# Altium schematic sheet Sheet1.SchDoc
size D
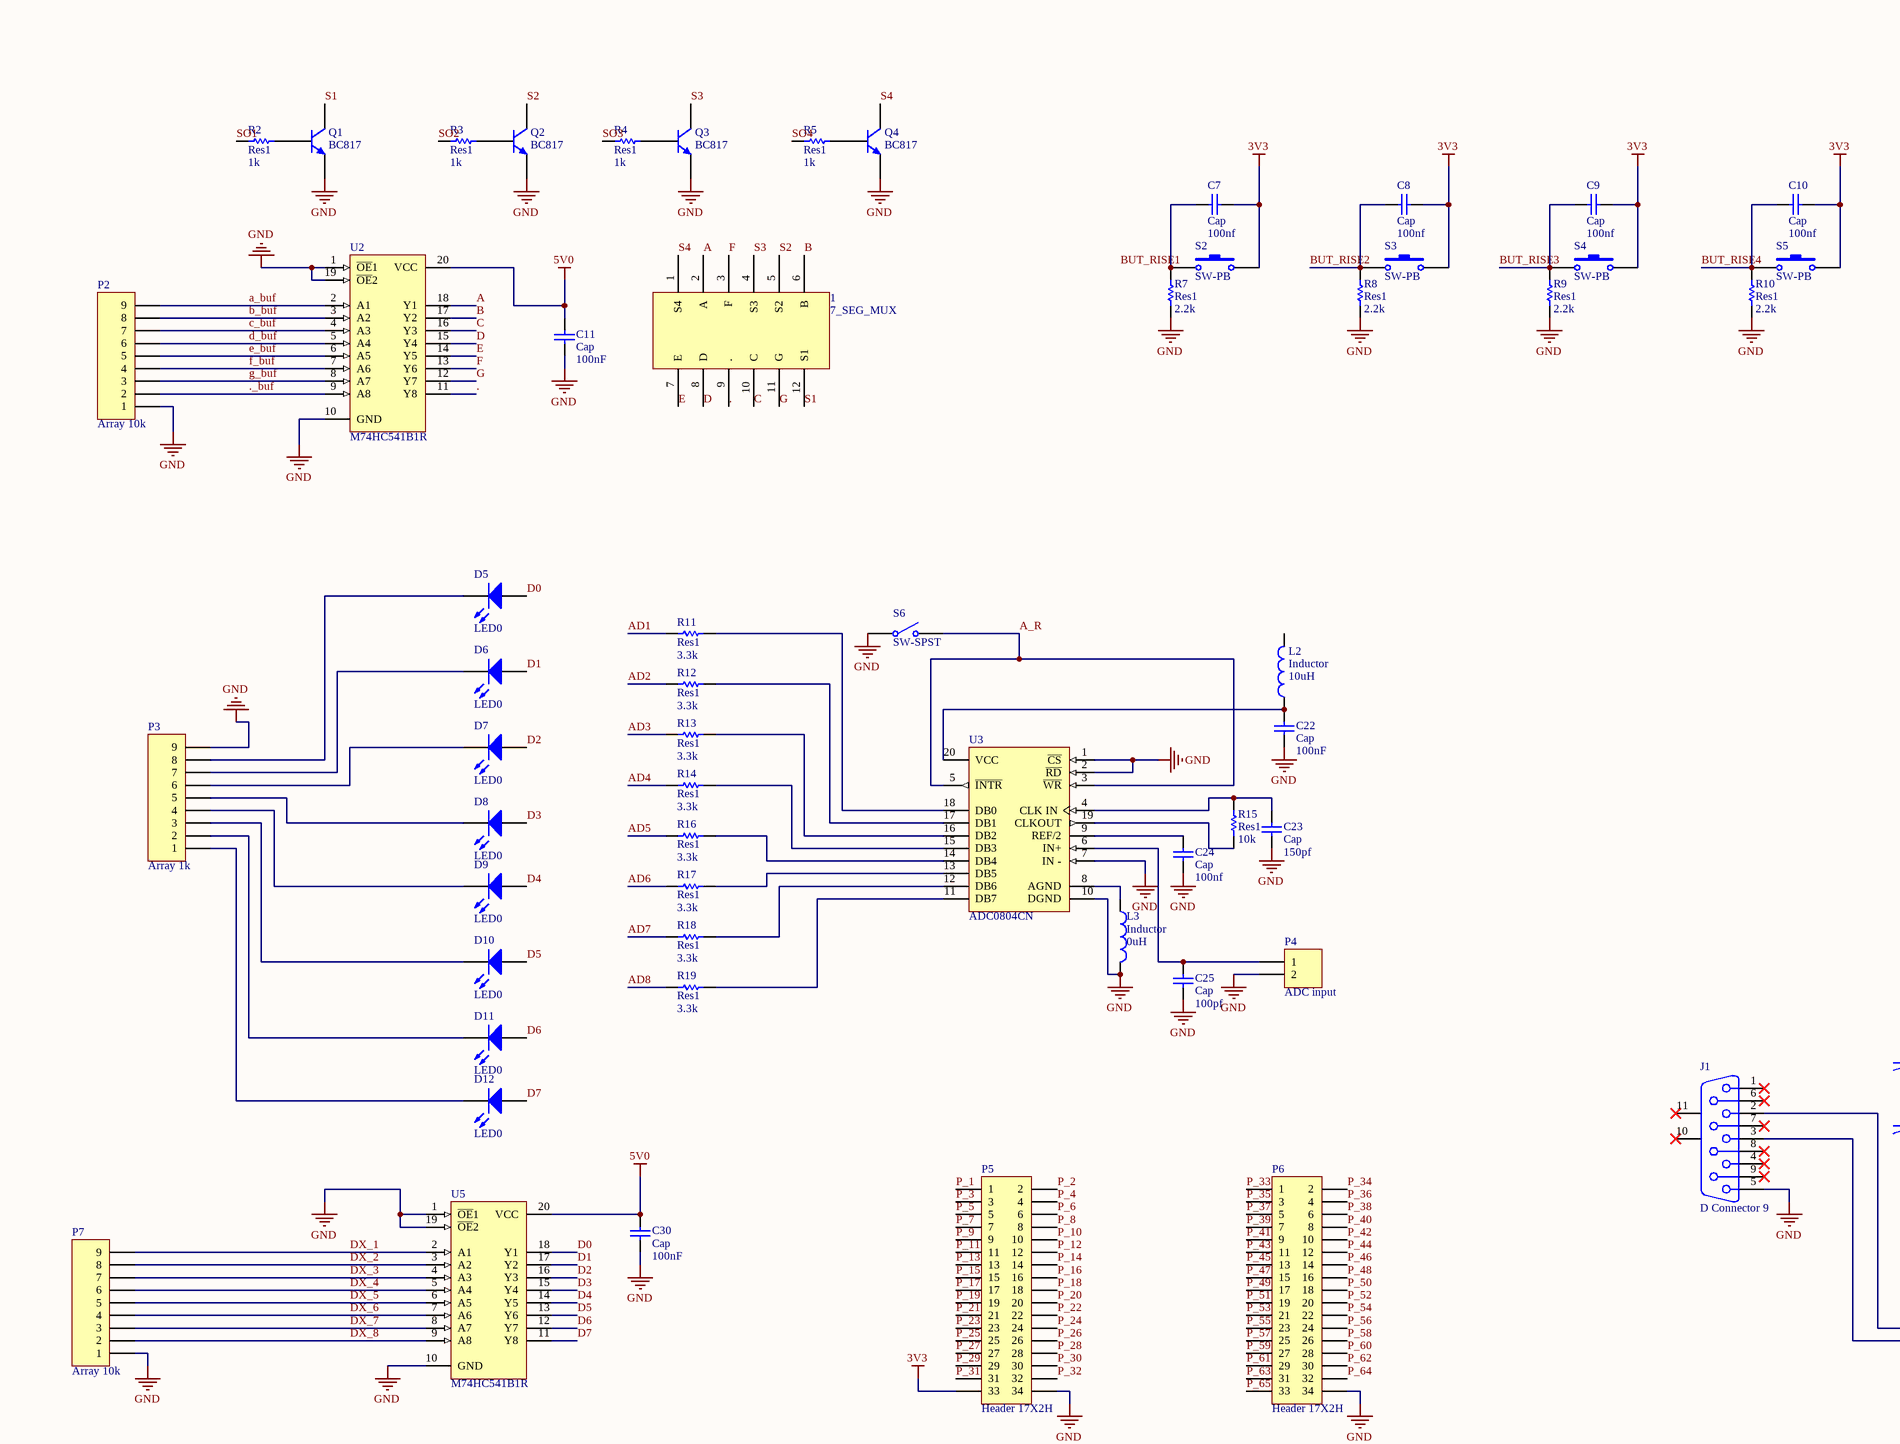
[diagram p0: Sheet1.SchDoc, top left]
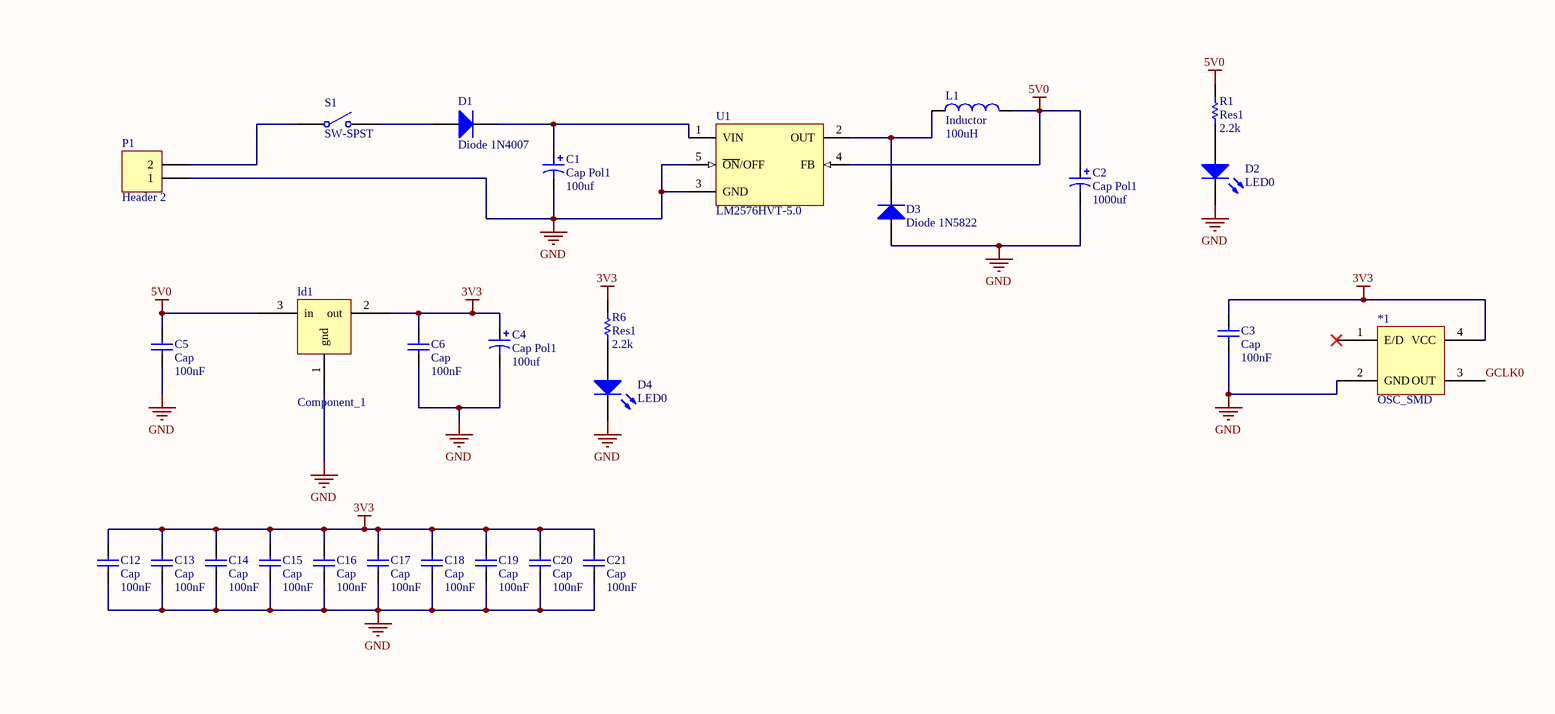
[diagram p1: Sheet1.SchDoc, top right]
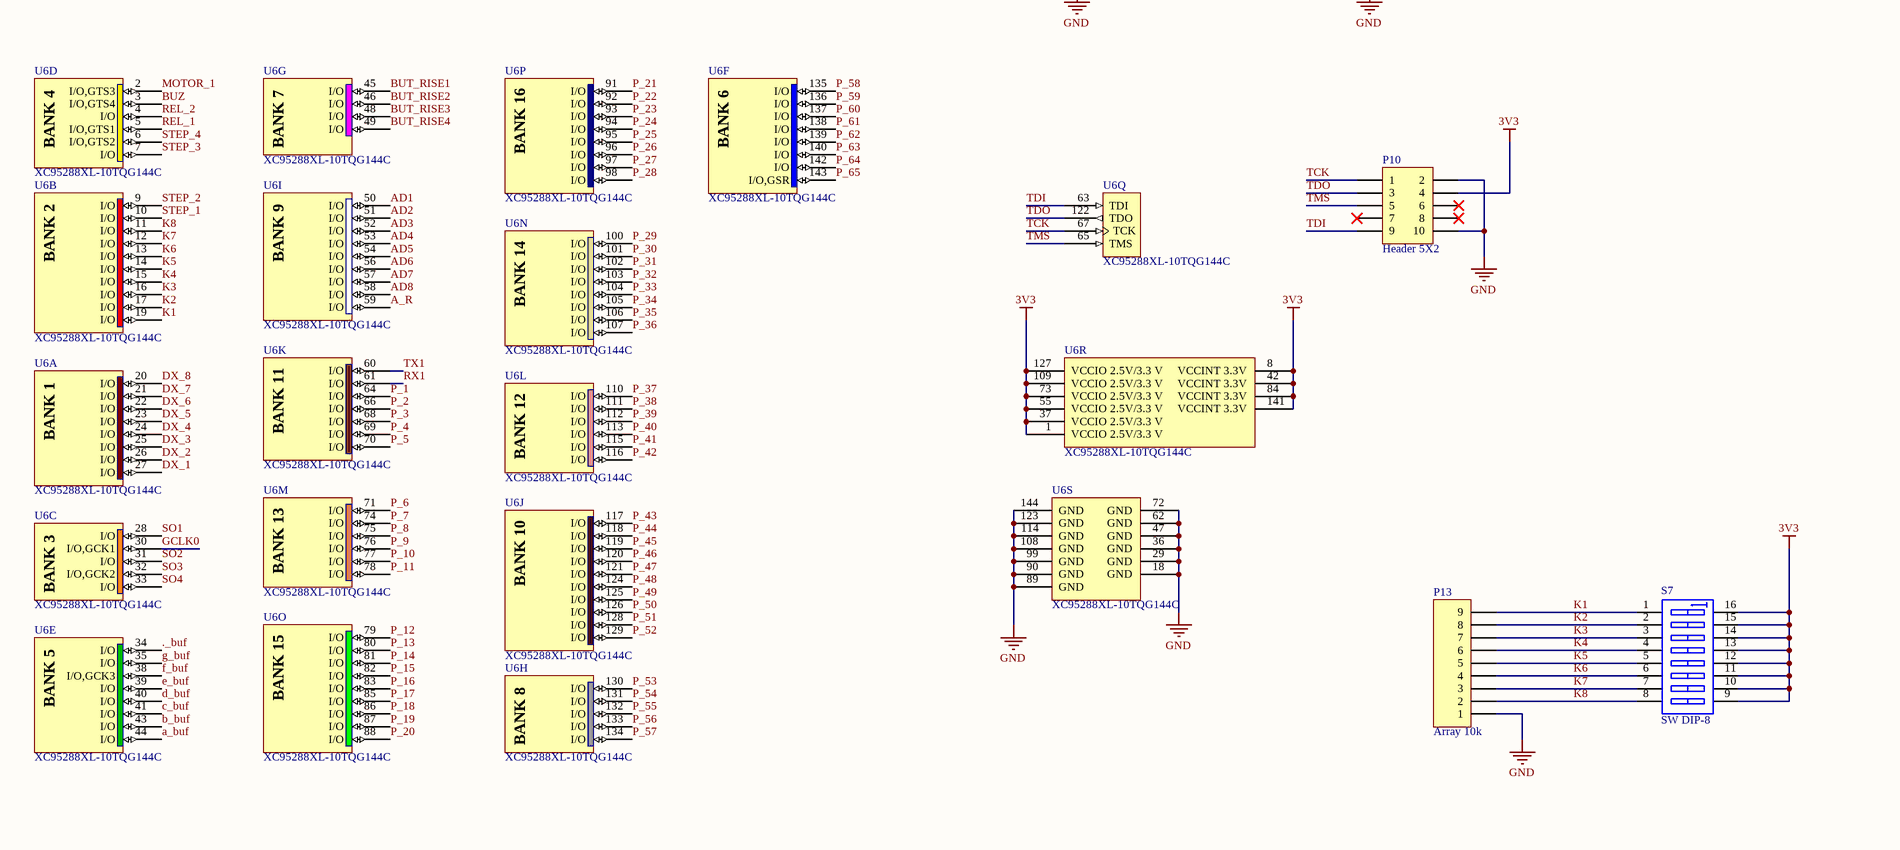
[diagram p2: Sheet1.SchDoc, bottom left]
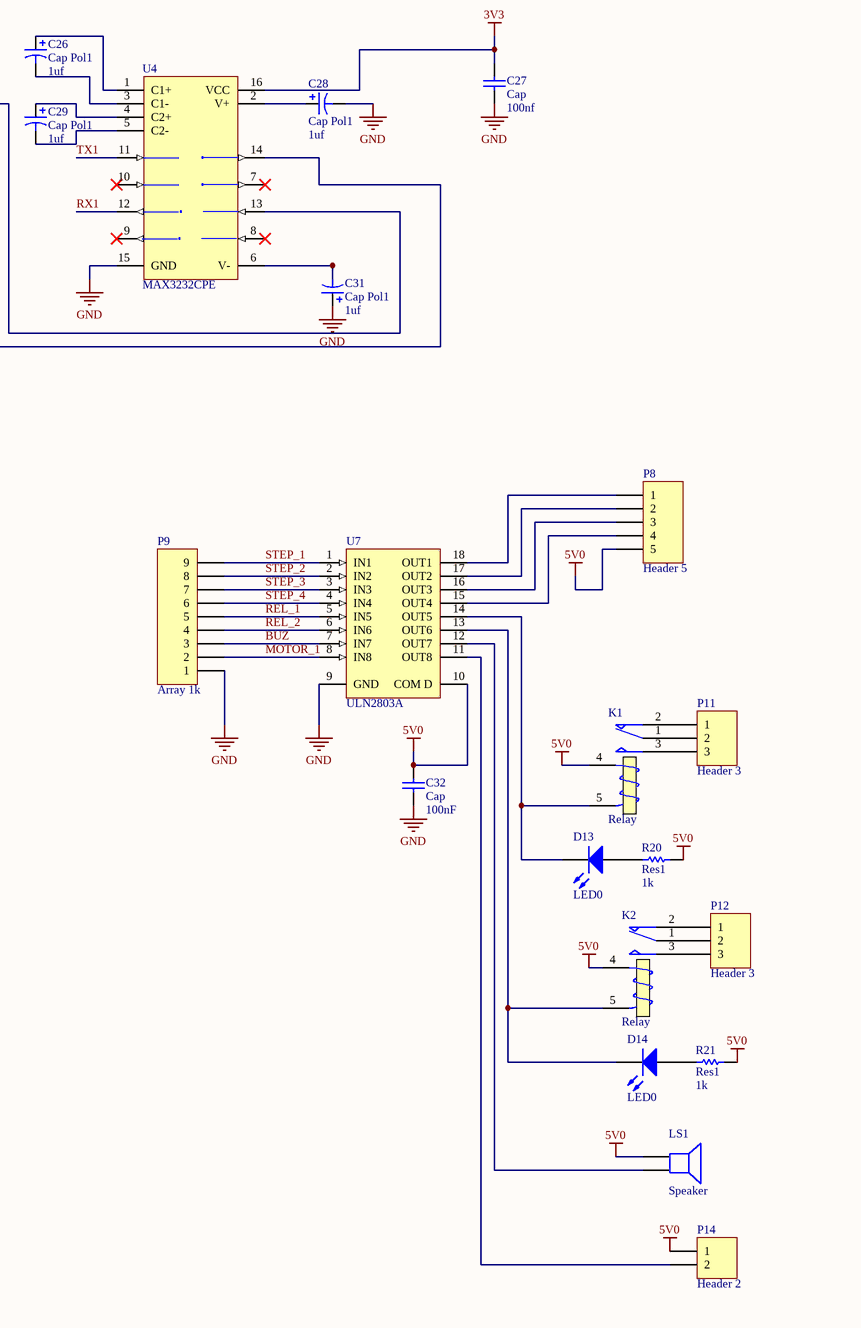
[diagram p3: Sheet1.SchDoc, bottom right]

## Parts
1  7_SEG_MUX  [s7_mux]
*1  OSC_SMD  [osc_smd]
C1  Cap Pol1  value 100uf  [C_CYL_SMD2]
C2  Cap Pol1  value 1000uf  [C_CYL_SMD]
C3  Cap  value 100nF  [SMD_805]
C4  Cap Pol1  value 100uf  [C_B]
C5  Cap  value 100nF  [SMD_805]
C6  Cap  value 100nF  [SMD_805]
C7  Cap  value 100nf  [SMD_805]
C8  Cap  value 100nf  [SMD_805]
C9  Cap  value 100nf  [SMD_805]
C10  Cap  value 100nf  [SMD_805]
C11  Cap  value 100nF  [SMD_805]
C12  Cap  value 100nF  [SMD_805]
C13  Cap  value 100nF  [SMD_805]
C14  Cap  value 100nF  [SMD_805]
C15  Cap  value 100nF  [SMD_805]
C16  Cap  value 100nF  [SMD_805]
C17  Cap  value 100nF  [SMD_805]
C18  Cap  value 100nF  [SMD_805]
C19  Cap  value 100nF  [SMD_805]
C20  Cap  value 100nF  [SMD_805]
C21  Cap  value 100nF  [SMD_805]
C22  Cap  value 100nF  [SMD_805]
C23  Cap  value 150pf  [SMD_805]
C24  Cap  value 100nf  [SMD_805]
C25  Cap  value 100pf  [SMD_805]
C26  Cap Pol1  value 1uf  [c_b]
C27  Cap  value 100nf  [SMD_805]
C28  Cap Pol1  value 1uf  [c_b]
C29  Cap Pol1  value 1uf  [c_b]
C30  Cap  value 100nF  [SMD_805]
C31  Cap Pol1  value 1uf  [c_b]
C32  Cap  value 100nF  [SMD_805]
D1  Diode 1N4007  [TVS]
D2  LED0  [SMD_805]
D3  Diode 1N5822  [1N5822]
D4  LED0  [SMD_805]
D5  LED0  [SMD_805]
D6  LED0  [SMD_805]
D7  LED0  [SMD_805]
D8  LED0  [SMD_805]
D9  LED0  [SMD_805]
D10  LED0  [SMD_805]
D11  LED0  [SMD_805]
D12  LED0  [SMD_805]
D13  LED0  [SMD_805]
D14  LED0  [SMD_805]
J1  D Connector 9  [com]
K1  Relay  [relay_5v]
K2  Relay  [relay_5v]
L1  Inductor  value 100uH  [INDUC_SMD]
L2  Inductor  value 10uH  [SMD_805]
L3  Inductor  value 0uH  [SMD_805]
ld1  Component_1  [SOT223]
LS1  Speaker  [buzzer]
P1  Header 2  [ADAP_JACK]
P2  Array 10k  [aray 9]
P3  Array 1k  [Aray 9]
P4  ADC input  [pin_2_w]
P5  Header 17X2H  [HDR2X17H]
P6  Header 17X2H  [HDR2X17H]
P7  Array 10k  [aray 9]
P8  Header 5  [pin_5_w]
P9  Array 1k  [aray 9]
P10  Header 5X2  [box2x5_3d]
P11  Header 3  [pin_3_w]
P12  Header 3  [pin_3_w]
P13  Array 10k  [aray 9]
P14  Header 2  [pin_2_w]
Q1  BC817  [sot23]
Q2  BC817  [sot23]
Q3  BC817  [sot23]
Q4  BC817  [sot23]
R1  Res1  value 2.2k  [SMD_805]
R2  Res1  value 1k  [SMD_805]
R3  Res1  value 1k  [SMD_805]
R4  Res1  value 1k  [SMD_805]
R5  Res1  value 1k  [SMD_805]
R6  Res1  value 2.2k  [SMD_805]
R7  Res1  value 2.2k  [SMD_805]
R8  Res1  value 2.2k  [SMD_805]
R9  Res1  value 2.2k  [SMD_805]
R10  Res1  value 2.2k  [SMD_805]
R11  Res1  value 3.3k  [SMD_805]
R12  Res1  value 3.3k  [SMD_805]
R13  Res1  value 3.3k  [SMD_805]
R14  Res1  value 3.3k  [SMD_805]
R15  Res1  value 10k  [SMD_805]
R16  Res1  value 3.3k  [SMD_805]
R17  Res1  value 3.3k  [SMD_805]
R18  Res1  value 3.3k  [SMD_805]
R19  Res1  value 3.3k  [SMD_805]
R20  Res1  value 1k  [SMD_805]
R21  Res1  value 1k  [SMD_805]
S1  SW-SPST  [KEY1]
S2  SW-PB  [res_b]
S3  SW-PB  [res_b]
S4  SW-PB  [res_b]
S5  SW-PB  [res_b]
S6  SW-SPST  [key1]
S7  SW DIP-8  [array_key8]
U1  LM2576HVT-5.0  [LM2576_SMD]
U2  M74HC541B1R  [sop20]
U3  ADC0804CN  [DIp_20p]
U4  MAX3232CPE  [sop16]
U5  M74HC541B1R  [sop20]
U6  XC95288XL-10TQG144C  [TQG144_N]  (parts A,B,C,D,E,F,G,H,I,J,K,L,M,N,O,P,Q,R,S of 19)
U7  ULN2803A  [sol18]

## Nets
3V3: *1.4(VCC) C3.1 C4.1 C6.1 C7.2 C8.2 C9.2 C10.2 C12.1 C13.1 C14.1 C15.1 C16.1 C17.1 C18.1 C19.1 C20.1 C21.1 C27.2 ld1.2(out) P5.33 P10.4 R6.2 S2.2 S3.2 S4.2 S5.2 S7.9(B8) S7.10(B7) S7.11(B6) S7.12(B5) S7.13(B4) S7.14(B3) S7.15(B2) S7.16(B1) U4.16(VCC) U6.1(VCCIO_2.5V/3.3_V) U6.8(VCCINT_3.3V) U6.37(VCCIO_2.5V/3.3_V) U6.42(VCCINT_3.3V) U6.55(VCCIO_2.5V/3.3_V) U6.73(VCCIO_2.5V/3.3_V) U6.84(VCCINT_3.3V) U6.109(VCCIO_2.5V/3.3_V) U6.127(VCCIO_2.5V/3.3_V) U6.141(VCCINT_3.3V)
5V0: C2.1 C5.1 C11.1 C30.1 C32.1 K1.4(T1) K2.4(T1) L1.2 ld1.3(in) LS1.1 P8.5 P14.1 R1.2 R20.2 R21.2 U1.4(FB) U2.20(VCC) U5.20(VCC) U7.10(COM_D)
GND: *1.2(GND) C1.2 C2.2 C3.2 C4.2 C5.2 C6.2 C11.2 C12.2 C13.2 C14.2 C15.2 C16.2 C17.2 C18.2 C19.2 C20.2 C21.2 C22.2 C23.2 C24.2 C25.2 C27.1 C28.2 C30.2 C31.1 C32.2 D2.2(K) D3.1(A) D4.2(K) J1.5 L3.2 ld1.1(gnd) P1.1 P2.1 P3.9 P4.2 P5.34 P6.34 P7.1 P9.1 P10.2 P10.10 P13.1 Q1.2(E) Q2.2(E) Q3.2(E) Q4.2(E) R7.2 R8.2 R9.2 R10.2 S6.1(COMMON) U1.3(GND) U1.5(~{ON}/OFF) U2.1(~{OE}1) U2.10(GND) U2.19(~{OE}2) U3.1(~{CS}) U3.2(~{RD}) U3.7(IN_-) U3.10(DGND) U4.15(GND) U5.1(~{OE}1) U5.10(GND) U5.19(~{OE}2) U6.18(GND) U6.29(GND) U6.36(GND) U6.47(GND) U6.62(GND) U6.72(GND) U6.89(GND) U6.90(GND) U6.99(GND) U6.108(GND) U6.114(GND) U6.123(GND) U6.144(GND) U7.9(GND)
.: 1.9(.) U2.11(Y8)
._buf: P2.2 U2.9(A8) U6.34(I/O)
A: 1.2(A) U2.18(Y1)
a_buf: P2.9 U2.2(A1) U6.44(I/O)
A_R: S6.2(NO) U3.3(~{WR}) U3.5(~{INTR}) U6.59(I/O)
AD1: R11.1 U6.50(I/O)
AD2: R12.1 U6.51(I/O)
AD3: R13.1 U6.52(I/O)
AD4: R14.1 U6.53(I/O)
AD5: R16.1 U6.54(I/O)
AD6: R17.1 U6.56(I/O)
AD7: R18.1 U6.57(I/O)
AD8: R19.1 U6.58(I/O)
B: 1.6(B) U2.17(Y2)
b_buf: P2.8 U2.3(A2) U6.43(I/O)
BUT_RISE1: U6.45(I/O)
BUT_RISE2: C8.1 R8.1 S3.1 U6.46(I/O)
BUT_RISE3: C9.1 R9.1 S4.1 U6.48(I/O)
BUT_RISE4: C10.1 R10.1 S5.1 U6.49(I/O)
BUZ: P9.3 U6.3(I/O,GTS4) U7.7(IN7)
C: 1.10(C) U2.16(Y3)
c_buf: P2.7 U2.4(A3) U6.41(I/O)
D: 1.8(D) U2.15(Y4)
D0: D5.1(A) U5.18(Y1)
D1: D6.1(A) U5.17(Y2)
D2: D7.1(A) U5.16(Y3)
D3: D8.1(A) U5.15(Y4)
D4: D9.1(A) U5.14(Y5)
D5: D10.1(A) U5.13(Y6)
D6: D11.1(A) U5.12(Y7)
D7: D12.1(A) U5.11(Y8)
d_buf: P2.6 U2.5(A4) U6.40(I/O)
DX_1: P7.9 U5.2(A1) U6.27(I/O)
DX_2: P7.8 U5.3(A2) U6.26(I/O)
DX_3: P7.7 U5.4(A3) U6.25(I/O)
DX_4: P7.6 U5.5(A4) U6.24(I/O)
DX_5: P7.5 U5.6(A5) U6.23(I/O)
DX_6: P7.4 U5.7(A6) U6.22(I/O)
DX_7: P7.3 U5.8(A7) U6.21(I/O)
DX_8: P7.2 U5.9(A8) U6.20(I/O)
E: 1.7(E) U2.14(Y5)
e_buf: P2.5 U2.6(A5) U6.39(I/O)
F: 1.3(F) U2.13(Y6)
f_buf: P2.4 U2.7(A6) U6.38(I/O,GCK3)
G: 1.11(G) U2.12(Y7)
g_buf: P2.3 U2.8(A7) U6.35(I/O)
GCLK0: *1.3(OUT) U6.30(I/O,GCK1)
K1: P13.9 S7.1(A1) U6.19(I/O)
K2: P13.8 S7.2(A2) U6.17(I/O)
K3: P13.7 S7.3(A3) U6.16(I/O)
K4: P13.6 S7.4(A4) U6.15(I/O)
K5: P13.5 S7.5(A5) U6.14(I/O)
K6: P13.4 S7.6(A6) U6.13(I/O)
K7: P13.3 S7.7(A7) U6.12(I/O)
K8: P13.2 S7.8(A8) U6.11(I/O)
MOTOR_1: P9.2 U6.2(I/O,GTS3) U7.8(IN8)
P_1: P5.1 U6.64(I/O)
P_2: P5.2 U6.66(I/O)
P_3: P5.3 U6.68(I/O)
P_4: P5.4 U6.69(I/O)
P_5: P5.5 U6.70(I/O)
P_6: P5.6 U6.71(I/O)
P_7: P5.7 U6.74(I/O)
P_8: P5.8 U6.75(I/O)
P_9: P5.9 U6.76(I/O)
P_10: P5.10 U6.77(I/O)
P_11: P5.11 U6.78(I/O)
P_12: P5.12 U6.79(I/O)
P_13: P5.13 U6.80(I/O)
P_14: P5.14 U6.81(I/O)
P_15: P5.15 U6.82(I/O)
P_16: P5.16 U6.83(I/O)
P_17: P5.17 U6.85(I/O)
P_18: P5.18 U6.86(I/O)
P_19: P5.19 U6.87(I/O)
P_20: P5.20 U6.88(I/O)
P_21: P5.21 U6.91(I/O)
P_22: P5.22 U6.92(I/O)
P_23: P5.23 U6.93(I/O)
P_24: P5.24 U6.94(I/O)
P_25: P5.25 U6.95(I/O)
P_26: P5.26 U6.96(I/O)
P_27: P5.27 U6.97(I/O)
P_28: P5.28 U6.98(I/O)
P_29: P5.29 U6.100(I/O)
P_30: P5.30 U6.101(I/O)
P_31: P5.31 U6.102(I/O)
P_32: P5.32 U6.103(I/O)
P_33: P6.1 U6.104(I/O)
P_34: P6.2 U6.105(I/O)
P_35: P6.3 U6.106(I/O)
P_36: P6.4 U6.107(I/O)
P_37: P6.5 U6.110(I/O)
P_38: P6.6 U6.111(I/O)
P_39: P6.7 U6.112(I/O)
P_40: P6.8 U6.113(I/O)
P_41: P6.9 U6.115(I/O)
P_42: P6.10 U6.116(I/O)
P_43: P6.11 U6.117(I/O)
P_44: P6.12 U6.118(I/O)
P_45: P6.13 U6.119(I/O)
P_46: P6.14 U6.120(I/O)
P_47: P6.15 U6.121(I/O)
P_48: P6.16 U6.124(I/O)
P_49: P6.17 U6.125(I/O)
P_50: P6.18 U6.126(I/O)
P_51: P6.19 U6.128(I/O)
P_52: P6.20 U6.129(I/O)
P_53: P6.21 U6.130(I/O)
P_54: P6.22 U6.131(I/O)
P_55: P6.23 U6.132(I/O)
P_56: P6.24 U6.133(I/O)
P_57: P6.25 U6.134(I/O)
P_58: P6.26 U6.135(I/O)
P_59: P6.27 U6.136(I/O)
P_60: P6.28 U6.137(I/O)
P_61: P6.29 U6.138(I/O)
P_62: P6.30 U6.139(I/O)
P_63: P6.31 U6.140(I/O)
P_64: P6.32 U6.142(I/O)
P_65: P6.33 U6.143(I/O,GSR)
REL_1: P9.5 U6.5(I/O,GTS1) U7.5(IN5)
REL_2: P9.4 U6.4(I/O) U7.6(IN6)
RX1: U4.12(R1OUT) U6.61(I/O)
S1: 1.12(S1) Q1.3(C)
S2: 1.5(S2) Q2.3(C)
S3: 1.4(S3) Q3.3(C)
S4: 1.1(S4) Q4.3(C)
SO1: R2.2 U6.28(I/O)
SO2: R3.2 U6.31(I/O)
SO3: R4.2 U6.32(I/O,GCK2)
SO4: R5.2 U6.33(I/O)
STEP_1: P9.9 U6.10(I/O) U7.1(IN1)
STEP_2: P9.8 U6.9(I/O) U7.2(IN2)
STEP_3: P9.7 U6.7(I/O) U7.3(IN3)
STEP_4: P9.6 U6.6(I/O,GTS2) U7.4(IN4)
TCK: P10.1 U6.67(TCK)
TDI: P10.9 U6.63(TDI)
TDO: P10.3 U6.122(TDO)
TMS: P10.5 U6.65(TMS)
TX1: U4.11(T1IN) U6.60(I/O)
NetC1_1: C1.1 D1.2(K) U1.1(VIN)
NetC7_1: C7.1 R7.1 S2.1
NetC22_1: C22.1 L2.1 U3.20(VCC)
NetC23_1: C23.1 R15.2 U3.4(CLK_IN)
NetC24_1: C24.1 U3.9(REF/2)
NetC25_1: C25.1 P4.1 U3.6(IN+)
NetC26_1: C26.1 U4.1(C1+)
NetC26_2: C26.2 U4.3(C1-)
NetC28_1: C28.1 U4.2(V+)
NetC29_1: C29.1 U4.4(C2+)
NetC29_2: C29.2 U4.5(C2-)
NetC31_2: C31.2 U4.6(V-)
NetD1_1: D1.1(A) S1.2(NO)
NetD2_1: D2.1(A) R1.1
NetD3_2: D3.2(K) L1.1 U1.2(OUT)
NetD4_1: D4.1(A) R6.1
NetD5_2: D5.2(K) P3.8
NetD6_2: D6.2(K) P3.7
NetD7_2: D7.2(K) P3.6
NetD8_2: D8.2(K) P3.5
NetD9_2: D9.2(K) P3.4
NetD10_2: D10.2(K) P3.3
NetD11_2: D11.2(K) P3.2
NetD12_2: D12.2(K) P3.1
NetD13_1: D13.1(A) R20.1
NetD13_2: D13.2(K) K1.5(T2) U7.14(OUT5)
NetD14_1: D14.1(A) R21.1
NetD14_2: D14.2(K) K2.5(T2) U7.13(OUT6)
NetJ1_2: J1.2 U4.13(R1IN)
NetJ1_3: J1.3 U4.14(T1OUT)
NetK1_1: K1.1(COM) P11.2
NetK1_2: K1.2(NC) P11.1
NetK1_3: K1.3(NO) P11.3
NetK2_1: K2.1(COM) P12.2
NetK2_2: K2.2(NC) P12.1
NetK2_3: K2.3(NO) P12.3
NetL3_1: L3.1 U3.8(AGND)
NetLS1_2: LS1.2 U7.12(OUT7)
NetP1_2: P1.2 S1.1(COMMON)
NetP8_1: P8.1 U7.18(OUT1)
NetP8_2: P8.2 U7.17(OUT2)
NetP8_3: P8.3 U7.16(OUT3)
NetP8_4: P8.4 U7.15(OUT4)
NetP14_2: P14.2 U7.11(OUT8)
NetQ1_1: Q1.1(B) R2.1
NetQ2_1: Q2.1(B) R3.1
NetQ3_1: Q3.1(B) R4.1
NetQ4_1: Q4.1(B) R5.1
NetR11_2: R11.2 U3.18(DB0)
NetR12_2: R12.2 U3.17(DB1)
NetR13_2: R13.2 U3.16(DB2)
NetR14_2: R14.2 U3.15(DB3)
NetR15_1: R15.1 U3.19(CLKOUT)
NetR16_2: R16.2 U3.14(DB4)
NetR17_2: R17.2 U3.13(DB5)
NetR18_2: R18.2 U3.12(DB6)
NetR19_2: R19.2 U3.11(DB7)

Not connected (* = marked no-connect by the designer): *1 1(E/D)*; J1 1* 4* 6* 7* 8* 9* 10(MH1)* 11(MH2)*; L2 2; P10 6* 7* 8*; U4 7(T2OUT)* 8(R2IN)* 9(R2OUT)* 10(T2IN)*

## Notes on the sheet
- Labels drawn without touching a wire or pin: BUT_RISE1
- (in symbol XC95288XL-10TQG144C, part A) BANK 1
- (in symbol XC95288XL-10TQG144C, part B) BANK 2
- (in symbol XC95288XL-10TQG144C, part C) BANK 3
- (in symbol XC95288XL-10TQG144C, part D) BANK 4
- (in symbol XC95288XL-10TQG144C, part E) BANK 5
- (in symbol XC95288XL-10TQG144C, part F) BANK 6
- (in symbol XC95288XL-10TQG144C, part G) BANK 7
- (in symbol XC95288XL-10TQG144C, part H) BANK 8
- (in symbol XC95288XL-10TQG144C, part I) BANK 9
- (in symbol XC95288XL-10TQG144C, part J) BANK 10
- (in symbol XC95288XL-10TQG144C, part K) BANK 11
- (in symbol XC95288XL-10TQG144C, part L) BANK 12
- (in symbol XC95288XL-10TQG144C, part M) BANK 13
- (in symbol XC95288XL-10TQG144C, part N) BANK 14
- (in symbol XC95288XL-10TQG144C, part O) BANK 15
- (in symbol XC95288XL-10TQG144C, part P) BANK 16

## Library data of the parts
1 *1 = Component_1
C1 C2 C4 C26 C28 C29 C31 = Cap Pol1: Polarized Capacitor (Radial); Published: 8-Jun-2000; LatestRevisionDate: 17-Jul-2002; LatestRevisionNote: Re-released for DXP Platform.; PackageReference: RB7.6-15; Publisher: Altium Limited
C3 C5-C25 C27 C30 C32 = Cap: Capacitor; Published: 8-Jun-2000; LatestRevisionDate: 17-Jul-2002; LatestRevisionNote: Re-released for DXP Platform.; PackageReference: RAD-0.3; Publisher: Altium Limited
D1 D3 = Diode 1N4007: 1 Amp General Purpose Rectifier; Published: 8-Jun-2000; LatestRevisionDate: 17-Jul-2002; LatestRevisionNote: Re-released for DXP Platform.; DatasheetVersion: 1998; PackageVersion: Aug-1999; PackageReference: DO-41; Publisher: Altium Limited; Code_JEDEC: DO-204-AL; ComponentLink1Description: Manufacturer Link; ComponentLink1URL: http://www.fairchildsemi.com/; ComponentLink2Description: Datasheet; ComponentLink2URL: http://www.fairchildsemi.com/ds/1N%2F1N4001.pdf
D2 D4-D14 = LED0: Typical INFRARED GaAs LED; Published: 8-Jun-2000; LatestRevisionDate: 08-Jul-2005; LatestRevisionNote: Mech Layer 1 removed.; PackageReference: LED-0; Publisher: Altium Limited
J1 = D Connector 9: Receptacle Assembly, 9 Position, Right Angle; PackageDocument: O; Positions: 9; Published: 15-Jun-2001; LatestRevisionDate: 17-Jul-2002; LatestRevisionNote: Re-released for DXP Platform.; DatasheetDocument: 1-Sep-1999; PackageReference: 788750; Publisher: Altium Limited; Orientation: Right Angle; Gender: Receptacle
K1 K2 = Relay: SPDT Relay; Published: 8-Jun-2000; LatestRevisionDate: 17-Jul-2002; LatestRevisionNote: Re-released for DXP Platform.; PackageReference: MODULE5B; Publisher: Altium Limited
L1-L3 = Inductor: Code_IEC: 1005; Published: 8-Jun-2000; LatestRevisionDate: 29-May-2009; LatestRevisionNote: IPC-7351 Footprint Added.; PackageReference: 0402-A; Publisher: Altium Limited; PackageDescription: Chip Inductor; Code_JEITA: 0402
LS1 = Speaker: Loudspeaker; Published: 24-Mar-1999; LatestRevisionDate: 17-Jul-2002; LatestRevisionNote: Re-released for DXP Platform.; PackageReference: PIN2; Publisher: Altium Limited
P1 P4 P14 = Header 2: Header, 2-Pin; LatestRevisionDate: 17-Jul-2002; LatestRevisionNote: Re-released for DXP Platform.; Publisher: Altium Limited
P2 P3 P7 P9 P13 = Header 9H: Header, 9-Pin, Right Angle; LatestRevisionDate: 17-Jul-2002; LatestRevisionNote: Re-released for DXP Platform.; Publisher: Altium Limited
P5 P6 = Header 17X2H: Header, 17-Pin, Dual row, Right Angle; LatestRevisionDate: 17-Jul-2002; LatestRevisionNote: Re-released for DXP Platform.; Publisher: Altium Limited
P8 = Header 5: Header, 5-Pin; LatestRevisionDate: 17-Jul-2002; LatestRevisionNote: Re-released for DXP Platform.; Publisher: Altium Limited
P10 = Header 5X2: Header, 5-Pin, Dual row; LatestRevisionDate: 17-Jul-2002; LatestRevisionNote: Re-released for DXP Platform.; Publisher: Altium Limited
P11 P12 = Header 3: Header, 3-Pin; LatestRevisionDate: 17-Jul-2002; LatestRevisionNote: Re-released for DXP Platform.; Publisher: Altium Limited
Q1-Q4 = 2N3904: NPN General Purpose Amplifier; Published: 8-Jun-2000; LatestRevisionDate: 15-Jan-2003; LatestRevisionNote: PCB Footprint 'BCY-W3/D4.7' replaced; DatasheetVersion: 1997; PackageVersion: Sep-1998; PackageReference: TO-92A; Publisher: Altium Limited; Code_JEDEC: TO-92A; ComponentLink1Description: Manufacturer Link; ComponentLink1URL: http://www.fairchildsemi.com/; ComponentLink2Description: Datasheet; ComponentLink2URL: http://www.fairchildsemi.com/ds/2N%2F2N3904.pdf
R1-R21 = Res1: Resistor; Published: 8-Jun-2000; LatestRevisionDate: 17-Jul-2002; LatestRevisionNote: Re-released for DXP Platform.; PackageReference: AXIAL-0.3; Publisher: Altium Limited
S1 S6 = SW-SPST: Single-Pole, Single-Throw Switch; Published: 24-Mar-1999; LatestRevisionDate: 17-Jul-2002; LatestRevisionNote: Re-released for DXP Platform.; PackageReference: SPST-2; Publisher: Altium Limited
S2-S5 = SW-PB: Switch; Published: 24-Mar-1999; LatestRevisionDate: 17-Jul-2002; LatestRevisionNote: Re-released for DXP Platform.; PackageReference: SPST-2; Publisher: Altium Limited
S7 = SW DIP-8: DIP Switch, 8 Position, SPST; Published: 24-Mar-1999; LatestRevisionDate: 17-Jul-2002; LatestRevisionNote: Re-released for DXP Platform.; PackageReference: DIP_SW_8WAY_SMD; Publisher: Altium Limited
U1 = LM2576HVT-5.0: SIMPLE SWITCHER; 3A Step-Down Voltage Regulator; Manufacturer: National Semiconductor; PackageTopMarking: NSUZXYTT*LM2576HVT*-5.0 P+; PowerWise: N; Published: 4-Dec-2008; DatasheetVersion: Aug-2004; PackageVersion: revJ, Jan-1992; PackageReference: T05A; Publisher: Altium Limited; PackageDescription: TO-220, Molded, 5 Lead, Straight; CompType: Switcher; PartNumber: LM2576HVT-5.0; RoHS: O; PinCount: 5; DigiKeyPartNumber: LM2576HVT-5.0-ND; Code_JEDEC: TO-220-AB; ComponentLink1Description: LM2576HV Datasheet; ComponentLink1URL: http://www.national.com/ds/LM/LM2576HV.pdf; ComponentLink2Description: LM2576HV Web Page; ComponentLink2URL: http://www.national.com/pf/LM/LM2576HV.html; ComponentLink3Description: T05A Package Page; ComponentLink3URL: http://www.national.com/packaging/folders/t05a.html
U2 U5 = M74HC541B1R: Octal Bus Buffer with 3 State Outputs (Non Inverted); Published: 8-Jun-2000; LatestRevisionDate: 06-Jun-2005; LatestRevisionNote: Stylized 3D Model Added.; DatasheetVersion: Oct-1993; PackageVersion: Jun-1998; PackageReference: DIP20; Publisher: Altium Limited; PackageDescription: DIP; 20 Leads; Row Spacing 7.62 mm; Pitch 2.54 mm; Code_JEDEC: MS-015-AE; ComponentLink1Description: Manufacturer Link; ComponentLink1URL: http://www.st.com/
U3 = ADC0804CN: 8-Bit Analog-to-Digital Converter with Differential Inputs; ComponentAvailability: Obsolete; Published: 15-Apr-2002; LatestRevisionDate: 08-Jul-2005; LatestRevisionNote: Stylized 3D Model Added.; DatasheetVersion: Oct-1988; PackageVersion: Oct-1995; PackageReference: N020; Publisher: Altium Limited; PackageDescription: DIP; 20 Leads; Row Spacing 7.62 mm; Pitch 2.54 mm; ComponentLink1Description: Manufacturer Link; ComponentLink1URL: http://www.ti.com/; ComponentLink2Description: Datasheet; ComponentLink2URL: http://www-s.ti.com/sc/ds/adc0804.pdf
U4 = MAX3232CPE: 3.0V TO 5.5V, Low-Power, up to 1Mbps, True RS-232 Transceiver Using Four 0.1µF External Capacitor; Published: 16-Jan-2001; LatestRevisionDate: 29-May-2009; LatestRevisionNote: Component Body Added.; DatasheetVersion: Mar-1999; PackageVersion: Aug-2000; PackageReference: PE16; Publisher: Altium Limited; PackageDescription: DIP, 16-Pin, Row Spacing 7.62 mm, Pitch 2.54 mm; Code_JEDEC: MS-001-BB; ComponentLink1Description: Manufacturer Link; ComponentLink1URL: http://www.maxim-ic.com/; ComponentLink2Description: Datasheet; ComponentLink2URL: http://pdfserv.maxim-ic.com/en/ds/MAX3222-MAX3241.pdf
U6 = XC95288XL-10TQG144C: FastFLASH XC900XL, 3.3V High-Performance CPLD with 288 Macrocells, 144-Pin TQFP, Commercial Grade, Pb-Free; Published: 8-Sep-2006; DatasheetVersion: ver2.0, Mar-2006; PackageVersion: ver1.2, Jun-2004; PackageReference: TQG144; Publisher: Altium Limited; PackageDescription: 144-Pin Thin Quad Flat Pack (TQG144) - Pb-Free; Code_JEDEC: MS-026-BFB; ComponentLink1Description: Manufacturer Link; ComponentLink1URL: http://www.xilinx.com/products/silicon_solutions/cplds/xc9500_series/xc9500xl/index.htm; ComponentLink2Description: Datasheet; ComponentLink2URL: http://direct.xilinx.com/bvdocs/publications/ds055.pdf
U7 = ULN2803A: High-Voltage, High-Current Darlington Array; Published: 13-Oct-2000; LatestRevisionDate: 06-Jun-2005; LatestRevisionNote: Stylized 3D Model Added.; DatasheetVersion: 1999; PackageVersion: 1999; PackageReference: A18; Publisher: Altium Limited; PackageDescription: DIP; 18 Leads; Row Spacing 7.62 mm; Pitch 2.54 mm; ComponentLink1Description: Manufacturer Link; ComponentLink1URL: http://www.allegromicro.com/